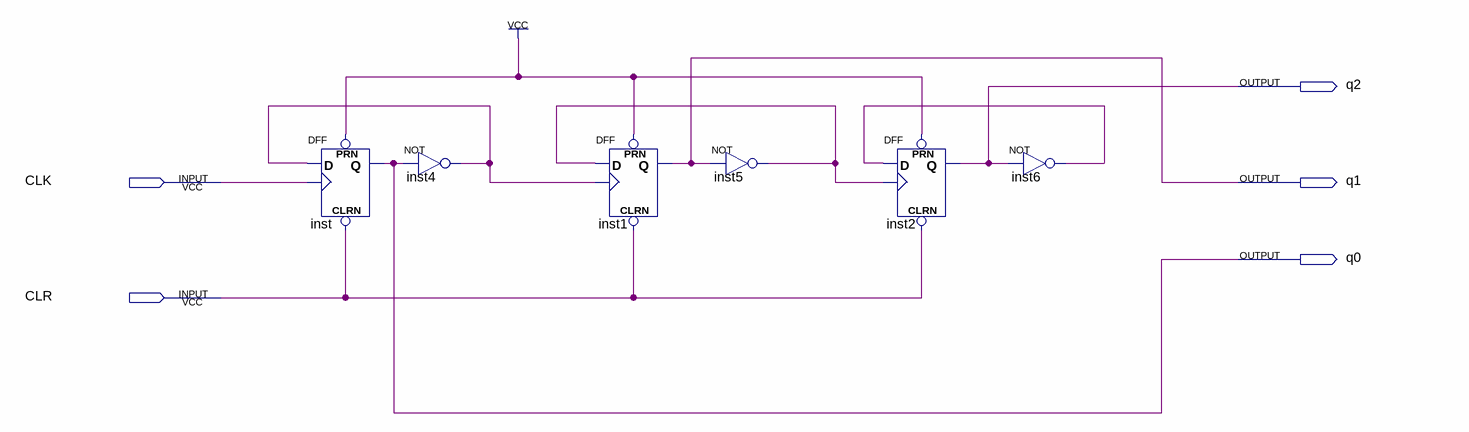
[diagram p0: schematic sheet]
// Quartus schematic yibumo8jia1.bdf as structural Verilog: 6 symbols, 5 pins
module yibumo8jia1 (
  input  CLK,
  input  CLR,
  output q2,
  output q1,
  output q0
);

  wire inst4_out, inst5_out, inst6_out;

  DFF inst (.CLRN(CLR), .CLK(CLK), .D(inst4_out), .PRN(1'b1), .Q(q0));
  not inst4 (inst4_out, q0);
  DFF inst1 (.CLRN(CLR), .CLK(inst4_out), .D(inst5_out), .PRN(1'b1), .Q(q1));
  not inst5 (inst5_out, q1);
  DFF inst2 (.CLRN(CLR), .CLK(inst5_out), .D(inst6_out), .PRN(1'b1), .Q(q2));
  not inst6 (inst6_out, q2);
endmodule
